# EAGLE design optical_modul (EAGLE 9.4.2)
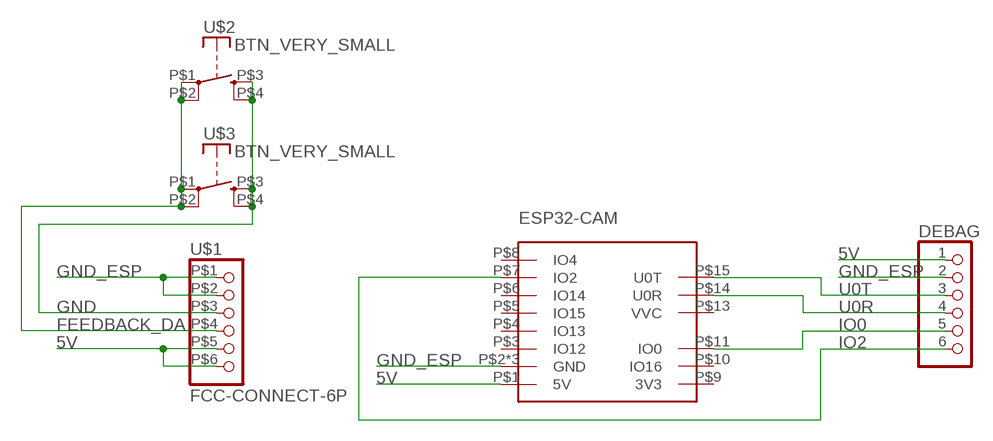
[diagram p0: schematic, sheet 1]

## Parts
DEBAG  PINHD-1X6  [1X06]
ESP32-CAM  ESP32-CAM  [ESP32-CAM]
U$1  FCC-CONNECT-6P  [FFC-CONNECT-6P-SMD]
U$2  BTN_VERY_SMALL  [BTN_VERY_SMALL]
U$3  BTN_VERY_SMALL  [BTN_VERY_SMALL]

## Nets
5V: DEBAG.1 ESP32-CAM.P$1(5V) U$1.P$5 U$1.P$6
FEEDBACK_DA: U$1.P$4 U$2.P$1(P) U$2.P$2(P) U$3.P$1(P) U$3.P$2(P)
GND: U$1.P$3 U$2.P$3(S) U$2.P$4(S) U$3.P$3(S) U$3.P$4(S)
GND_ESP: DEBAG.2 ESP32-CAM.P$2(GND) ESP32-CAM.P$12(GND) ESP32-CAM.P$16(GND) U$1.P$1 U$1.P$2
IO0: DEBAG.5 ESP32-CAM.P$11(IO0)
IO2: DEBAG.6 ESP32-CAM.P$7(IO2)
U0R: DEBAG.4 ESP32-CAM.P$14(U0R)
U0T: DEBAG.3 ESP32-CAM.P$15(U0T)
Unconnected: ESP32-CAM.P$3(IO12) ESP32-CAM.P$4(IO13) ESP32-CAM.P$5(IO15) ESP32-CAM.P$6(IO14) ESP32-CAM.P$8(IO4) ESP32-CAM.P$9(3V3) ESP32-CAM.P$10(IO16) ESP32-CAM.P$13(VVC)

## Library data of the parts
DEBAG = pinhead:PINHD-1X6: PIN HEADER
ESP32-CAM = NEON-BLADE-2023:ESP32-CAM
U$1 = NEON-BLADE-2023:FCC-CONNECT-6P
U$2 U$3 = NEON-BLADE-2023:BTN_VERY_SMALL

## Board
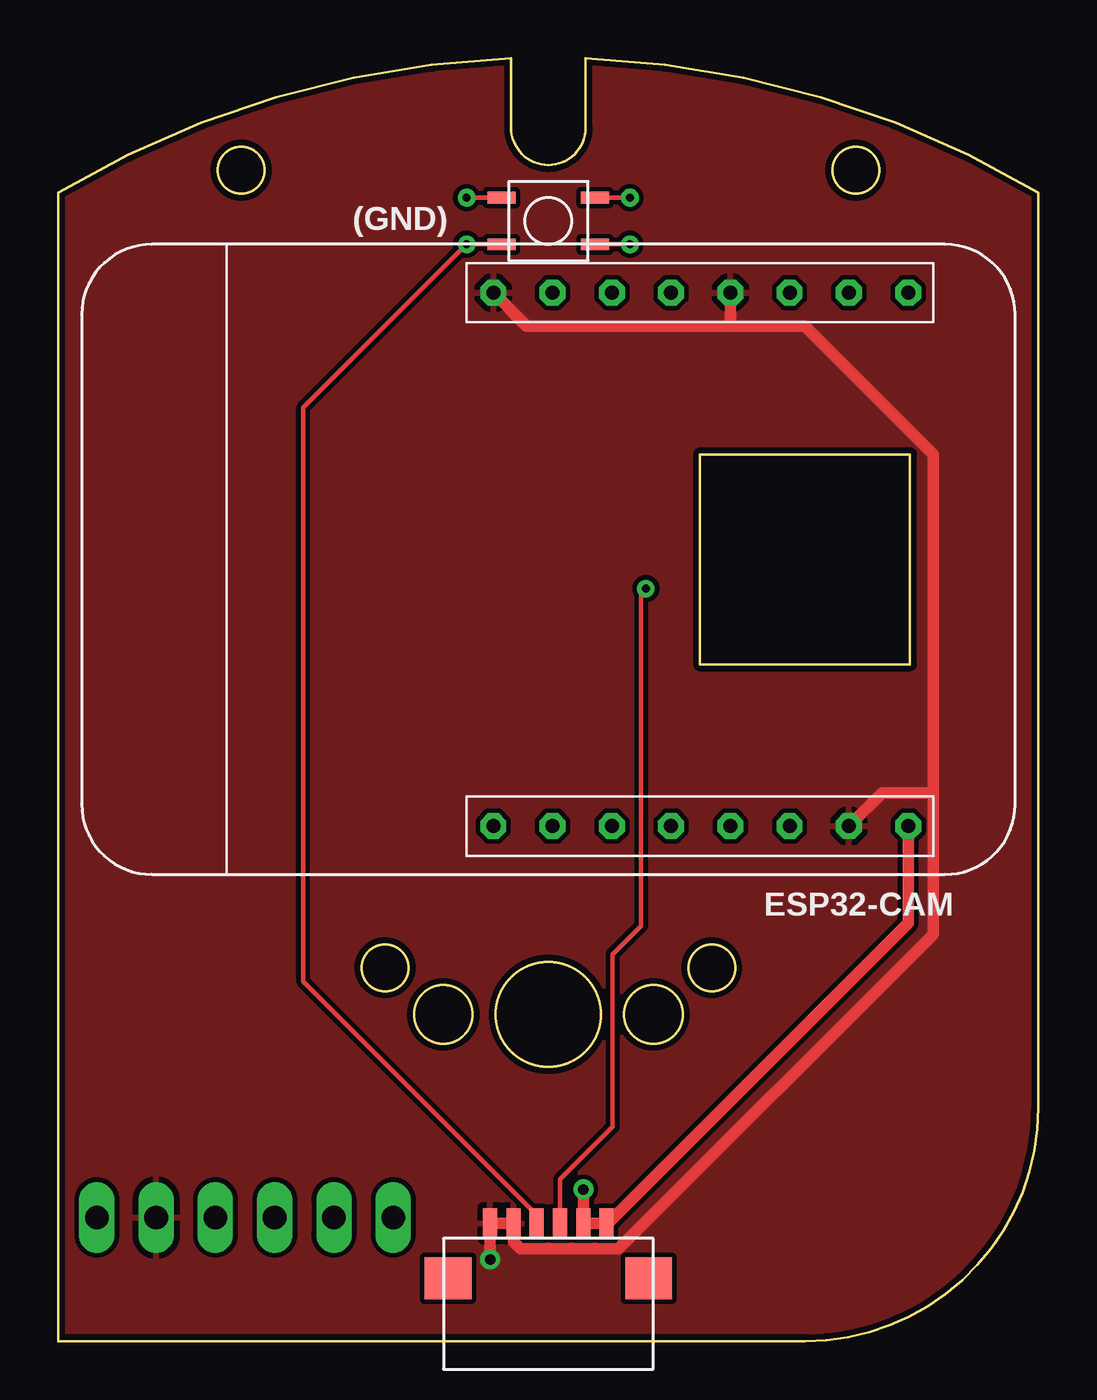
[diagram p1: board, top side]
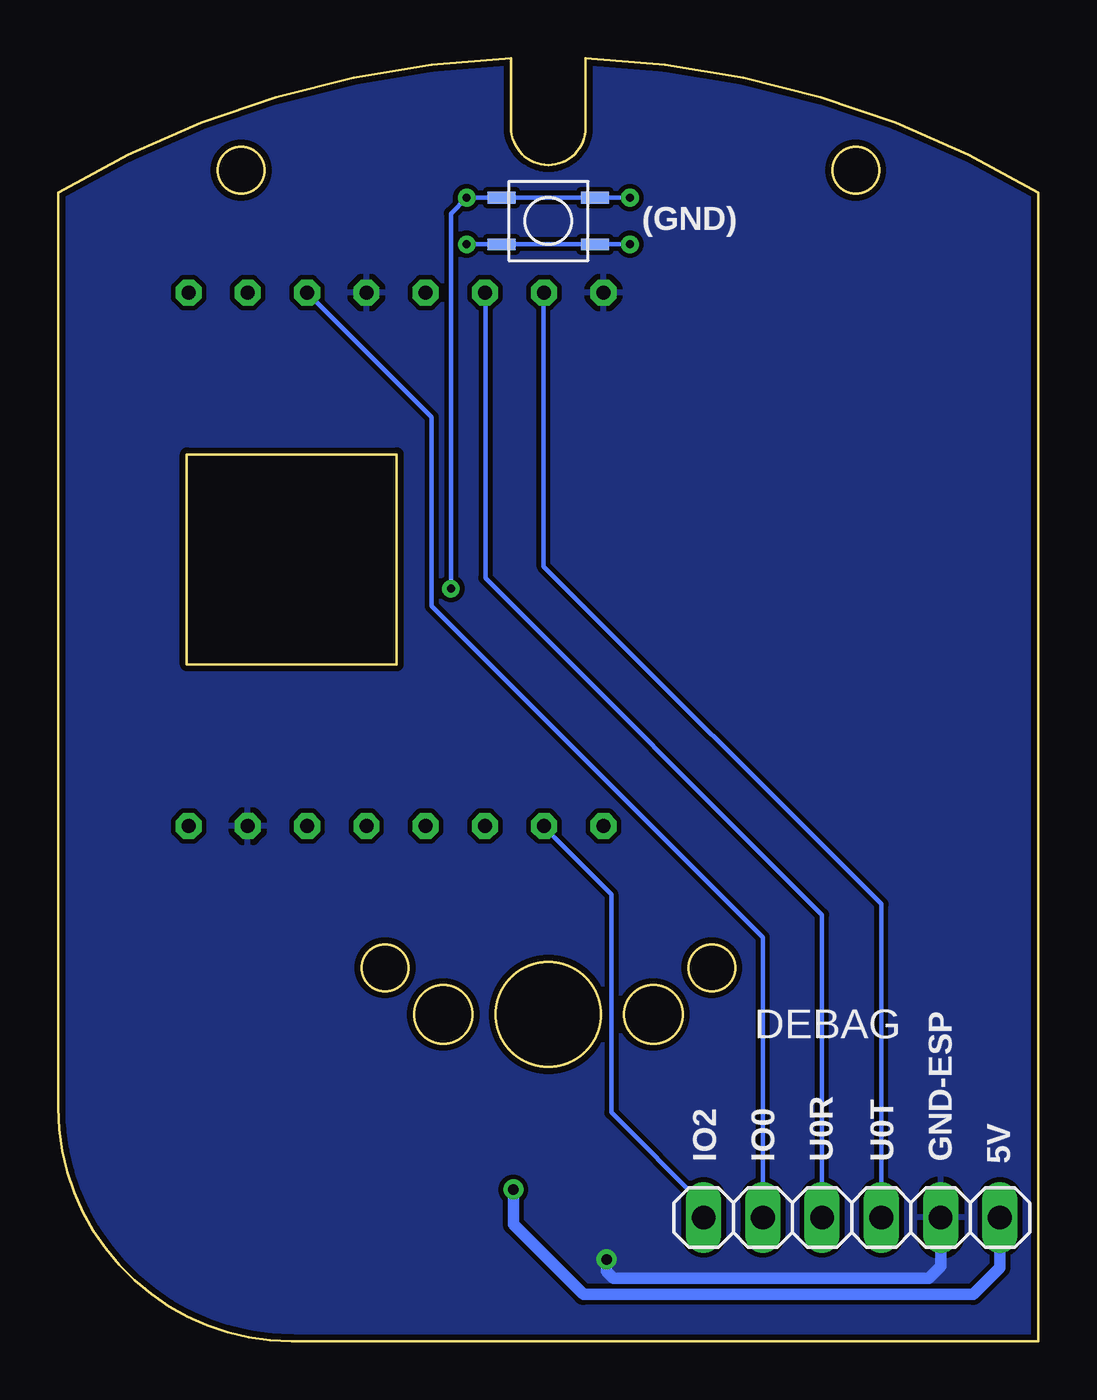
[diagram p2: board, bottom side, seen from below]

Size 42 x 54.97 mm. Coordinates in mm from the lower left corner, seen from the top.
Outline: 32,0 0,0 0,49.21 arc-29 19.4,54.97 19.4,52 arc180 22.6,52 22.6,54.97 arc-29 42,49.21 42,10 arc-90 32,0
Outline: 27.5,29 36.5,29 36.5,38 27.5,38 27.5,29
Outline: circle at 21,14 radius 2.25
Outline: circle at 25.5,14 radius 1.25
Outline: circle at 16.5,14 radius 1.25
Outline: circle at 34.17,50.18 radius 1
Outline: circle at 28,16 radius 1
Outline: circle at 7.83,50.18 radius 1
Outline: circle at 14,16 radius 1
Copper layers (1*16): Top 0.035mm / dielectric 1.5mm / Bottom 0.035mm
Design rules "default *": minimum track width 0.2mm, minimum drill 0.35mm, track to track 0.2mm, track to pad 0.2mm, pad to pad 0.2mm, via to via 0.2mm, smd to smd 0.2mm, copper to edge 0.25mm, drill to drill 6mil, minimum pad ring 10mil, minimum via ring 8mil, stop-mask expansion 4mil, vias tented up to drill 0mil, thermal gap 10mil

### Footprints (pad centres in the part's own frame; a part is rotated, then mirrored left to right if it is on the bottom)
1X06 = drill 1.016 long: 1 -6.35,0; 2 -3.81,0; 3 -1.27,0; 4 1.27,0; 5 3.81,0; 6 6.35,0
ESP32-CAM = drill 0.6 octagon: P$1 -11.43,-15.42; P$2 -11.43,-12.88; P$3 -11.43,-10.34; P$4 -11.43,-7.8; P$5 -11.43,-5.26; P$6 -11.43,-2.72; P$7 -11.43,-0.18; P$8 -11.43,2.36; P$9 11.43,-15.42; P$10 11.43,-12.88; P$11 11.43,-10.34; P$12 11.43,-7.8; P$13 11.43,-5.26; P$14 11.43,-2.72; P$15 11.43,-0.18; P$16 11.43,2.36
FFC-CONNECT-6P-SMD = smd 0.6 x 1.3: P$1 -7,0.65; P$2 -6,0.65; P$3 -5,0.65; P$4 -4,0.65; P$5 -3,0.65; P$6 -2,0.65 | smd 2 x 1.8: P$16 -0.2,-1.7; P$17 -8.8,-1.7
BTN_VERY_SMALL = smd 1.2 x 0.5: P$1 -2,1; P$2 2,1; P$3 2,-1; P$4 -2,-1

### Placement (x,y rotation side)
DEBAG  8,5.3 180 bottom
ESP32-CAM  21,33.5 90 top
U$1  25.5,4.4 0 top
U$2  21,48 0 top
U$3  21,48 0 bottom

### Tracks (layer width: path | path; a pad name or v marks a point on that pad's centre or on a via)
5V  (via drill 0.45)
  Top 0.5: ESP32-CAM.P$1 36.42,17.92 23.55,5.05 U$1.P$6 U$1.P$5 v22.5,6.5
  Bottom 0.5: DEBAG.1 1.65,3.15 2.8,2 19.5,2 22.5,5 v22.5,6.5
FEEDBACK_DA  (via drill 0.35)
  Top 0.2: v25.18,32.25 24.98,32.05 24.98,17.8 23.75,16.57 23.75,9.17 21.5,6.92 U$1.P$4 | v17.5,49 U$3.P$2 | v24.5,49 U$3.P$1
  Bottom 0.2: v17.5,49 U$3.P$2 U$3.P$1 v24.5,49 25.18,48.32 v25.18,32.25
GND  (via drill 0.35)
  Top 0.2: U$3.P$3 v17.5,47 10.5,40 10.5,15.42 20.5,5.42 U$1.P$3 | U$3.P$4 v24.5,47
  Bottom 0.2: v17.5,47 U$3.P$3 U$3.P$4 v24.5,47
GND_ESP  (via drill 0.45)
  Top 0.2: 28.8,44.97 ESP32-CAM.P$12
  Top 0.5: 28.8,43.5 32,43.5 37.5,38 37.5,23.5 | 28.8,44.97 28.8,43.5 | 37.5,23.5 37.5,17.44 24.01,3.95 19.8,3.95 19.5,4.25 U$1.P$2 U$1.P$1 v18.5,3.5 | ESP32-CAM.P$2 35.31,23.5 37.5,23.5 | ESP32-CAM.P$16 20.07,43.5 28.8,43.5
  Bottom 0.5: DEBAG.2 4.19,3.2 4.69,2.7 18.2,2.7 18.5,3 v18.5,3.5
  pour Top: -0.2,55.2 -0.2,-0.3 42.2,-0.3 42.2,55.2
  pour Bottom: -0.5,55.4 42.5,55.4 42.5,-0.6 -0.5,-0.6
IO0
  Bottom 0.2: DEBAG.5 11.81,17.31 26,31.5 26,39.59 ESP32-CAM.P$11
IO2
  Bottom 0.2: DEBAG.6 14.35,5.85 18.3,9.8 18.3,19.15 21.18,22.03 ESP32-CAM.P$7
U0R
  Bottom 0.2: DEBAG.4 9.27,18.27 23.7,32.7 23.7,44.91 ESP32-CAM.P$14
U0T
  Bottom 0.2: DEBAG.3 6.73,18.73 21.2,33.2 21.2,44.91 ESP32-CAM.P$15

### Text on the board
tNames: (GND)
bNames: (GND) | 5V | GND-ESP | U0T | U0R | IO0 | IO2